# EAGLE design Linkable_LED_Matrix (EAGLE 7.0.0)
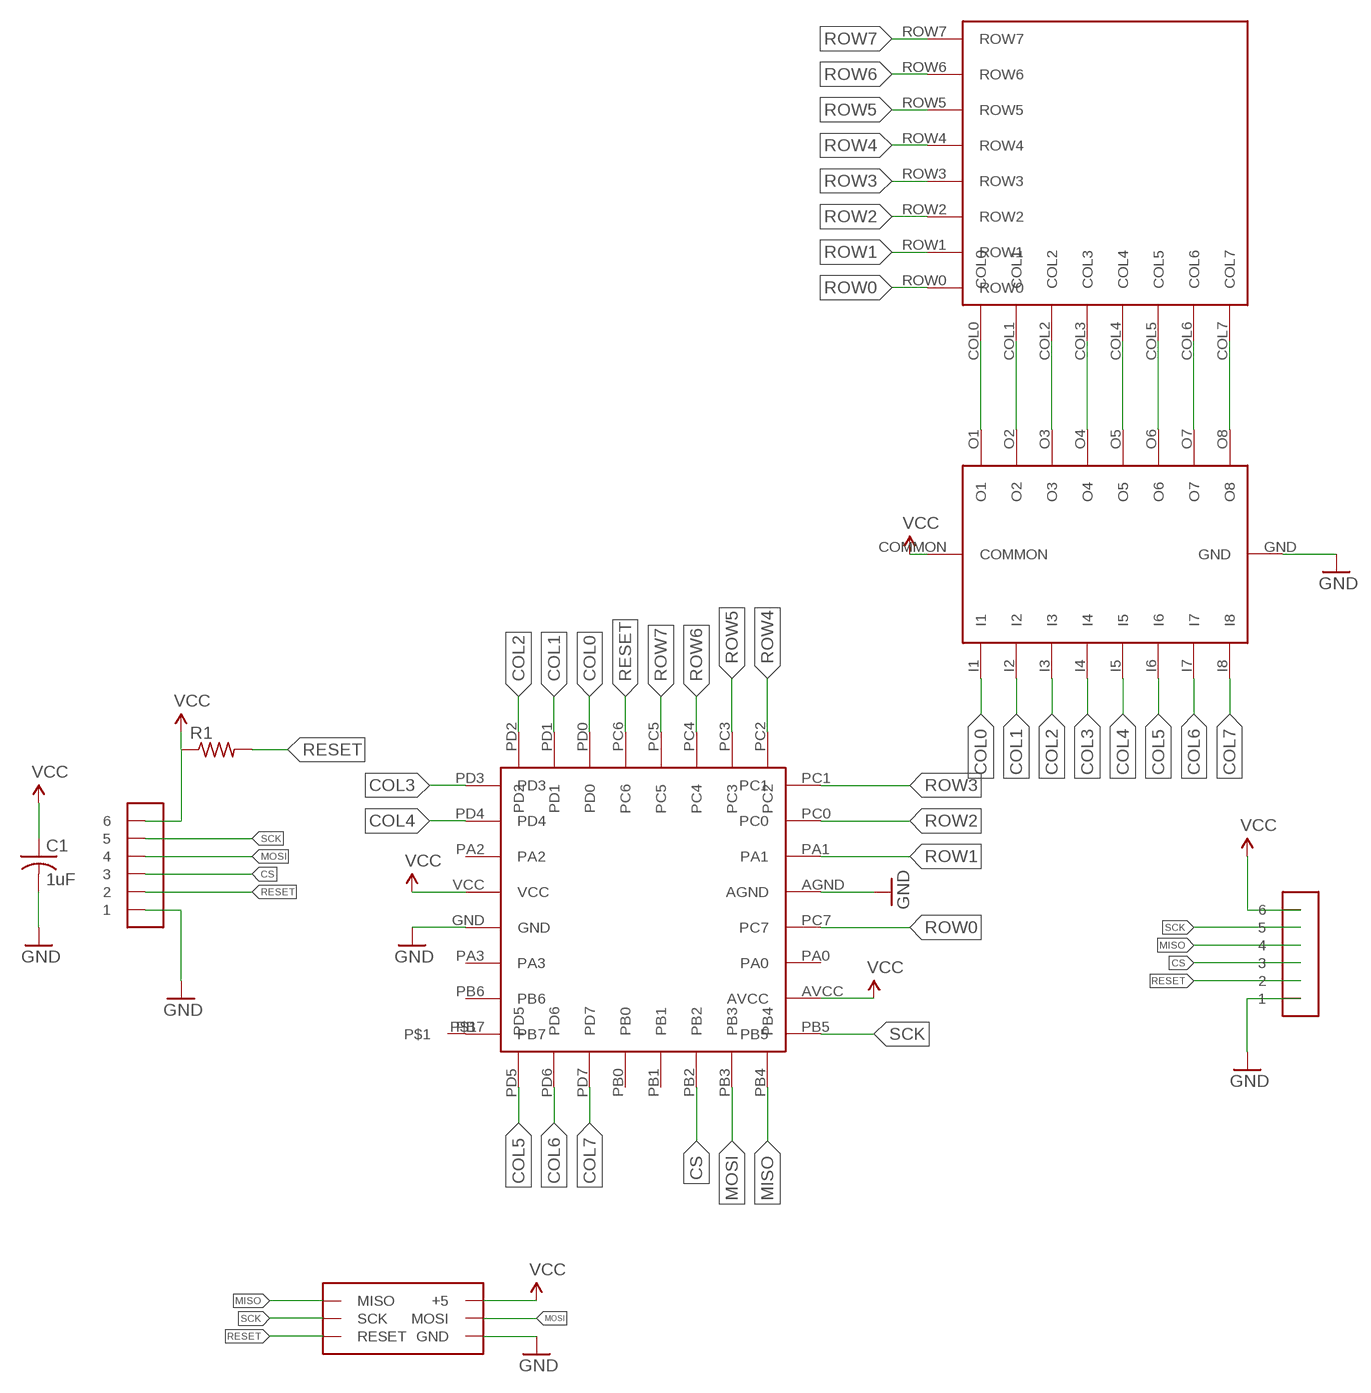
[diagram p0: schematic, sheet 1]

## Parts
C1  1uF  C-USC0603  [C0603]
R1  R-US_R0603  [R0603]
U$1  ATTINY48  [ATTINY48]
U$2  ULN2803AFWG  [ULN2803AFWG]
U$3  8X8_LED_MATRIX  [8X8_LED_MATRIX]
U$5  1X1MM_PAD  [1X1MM_PAD]
U$6  DIP1X6MALE  [DIP1X6MALE]
U$7  DIP1X6MALE  [DIP1X6MALE]
U$9  DIP2X3MALE  [DIP2X3MALE]

## Nets
COL0: U$1.PD0 U$2.I1
COL1: U$1.PD1 U$2.I2
COL2: U$1.PD2 U$2.I3
COL3: U$1.PD3 U$2.I4
COL4: U$1.PD4 U$2.I5
COL5: U$1.PD5 U$2.I6
COL6: U$1.PD6 U$2.I7
COL7: U$1.PD7 U$2.I8
CS: U$1.PB2 U$6.3 U$7.3
GND: C1.2 U$1.AGND U$1.GND U$2.GND U$6.1 U$7.1 U$9.GND
MISO: U$1.PB4 U$7.4 U$9.MISO
MOSI: U$1.PB3 U$6.4 U$9.MOSI
N$1: U$2.O1 U$3.COL0
N$2: U$2.O2 U$3.COL1
N$3: U$2.O3 U$3.COL2
N$4: U$2.O4 U$3.COL3
N$5: U$2.O5 U$3.COL4
N$6: U$2.O6 U$3.COL5
N$7: U$2.O7 U$3.COL6
N$8: U$2.O8 U$3.COL7
N$13: U$1.PB7 U$5.P$1
RESET: R1.2 U$1.PC6 U$6.2 U$7.2 U$9.RESET
ROW0: U$1.PC7 U$3.ROW0
ROW1: U$1.PA1 U$3.ROW1
ROW2: U$1.PC0 U$3.ROW2
ROW3: U$1.PC1 U$3.ROW3
ROW4: U$1.PC2 U$3.ROW4
ROW5: U$1.PC3 U$3.ROW5
ROW6: U$1.PC4 U$3.ROW6
ROW7: U$1.PC5 U$3.ROW7
SCK: U$1.PB5 U$6.5 U$7.5 U$9.SCK
VCC: C1.1 R1.1 U$1.AVCC U$1.VCC U$2.COMMON U$6.6 U$7.6 U$9.5V(+5)
Unconnected: U$1.PA0 U$1.PA2 U$1.PA3 U$1.PB0 U$1.PB1 U$1.PB6

## Library data of the parts
C1 = resistor:C-US: CAPACITOR, American symbol
R1 = resistor:R-US_: RESISTOR, American symbol
U$1 = ScottSilver:ATTINY48
U$2 = ScottSilver:ULN2803AFWG
U$3 = ScottSilver:8X8_LED_MATRIX
U$5 = ScottSilver:1X1MM_PAD
U$6 U$7 = ScottSilver:DIP1X6MALE
U$9 = ScottSilver:DIP2X3MALE

## Board
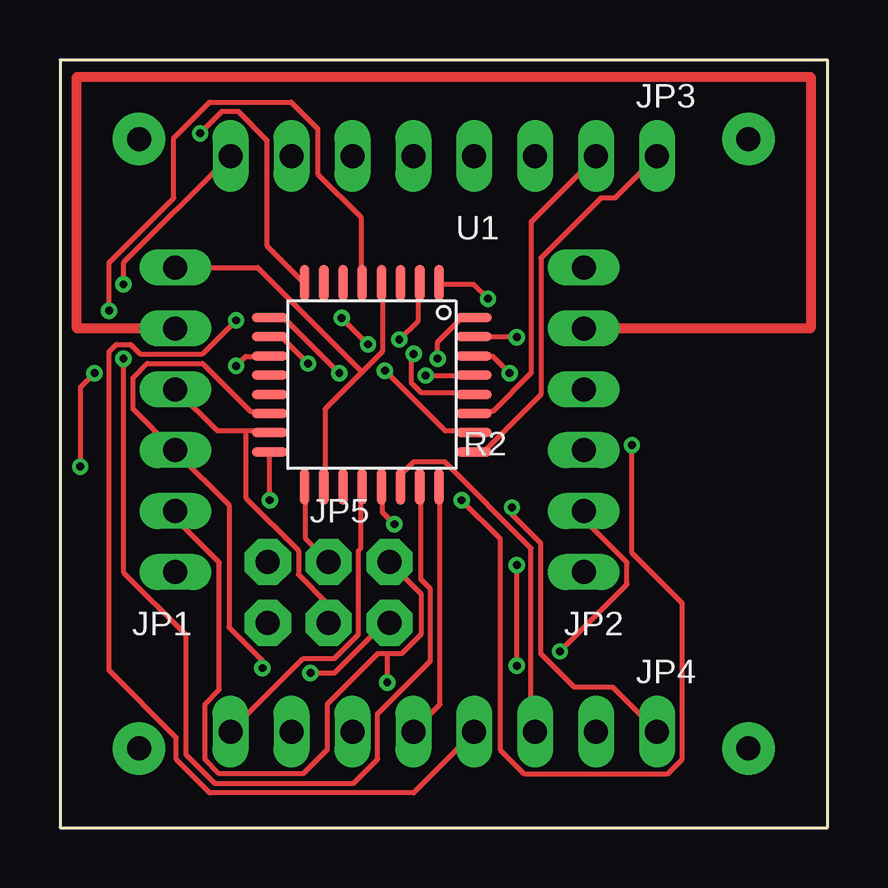
[diagram p1: board, top side]
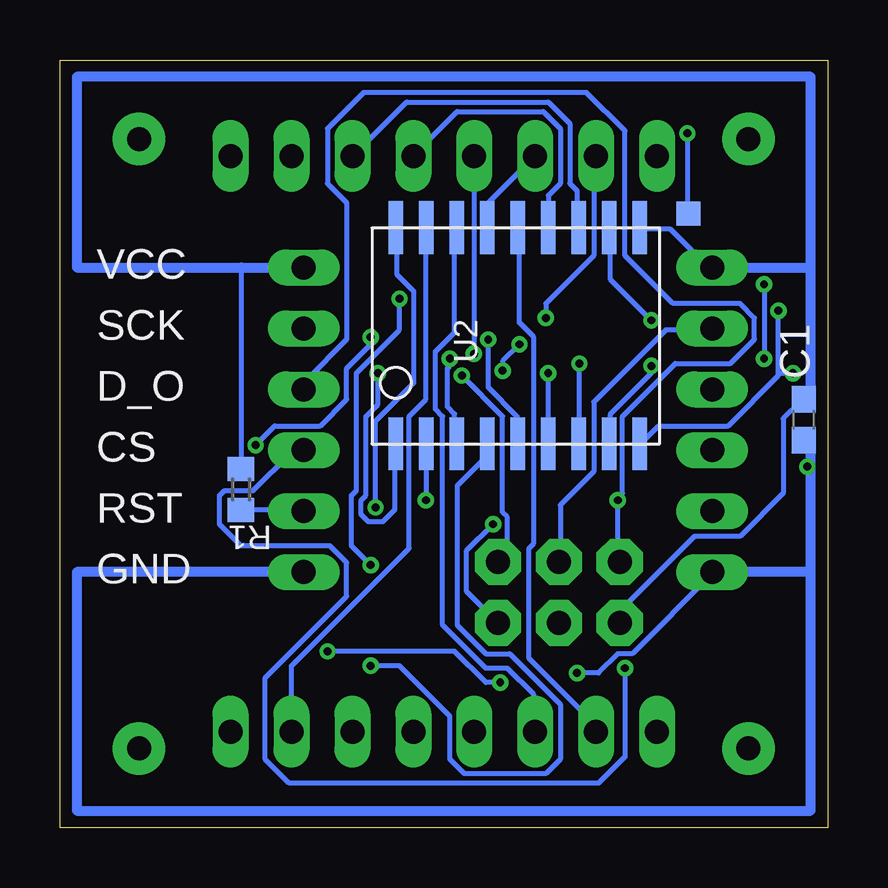
[diagram p2: board, bottom side, seen from below]

Size 32 x 32 mm. Coordinates in mm from the lower left corner, seen from the top.
Outline: 0,0 32,0 32,32 0,32 0,0
Copper layers (1*16): Top 0.0356mm / dielectric 1.5011mm / Bottom 0.0356mm
Design rules "LaenPCBOrder *": minimum track width 8mil, minimum drill 13mil, track to track 6mil, track to pad 6mil, pad to pad 6mil, via to via 6mil, smd to smd 6mil, copper to edge 15mil, drill to drill 6mil, minimum pad ring 7mil, minimum via ring 7mil, stop-mask expansion 3mil, vias tented up to drill 0mil, thermal gap 10mil
vRestrict: area 6.2,26.4 to 25.7,29.6; area 6.2,2.5 to 25.8,5.6; area 20.4,9.8 to 23.3,24.1; area 7.2,7.3 to 15.2,12.3; area 6.7,23.5 to 18.7,26.5; area 7.1,14.6 to 18.9,17.4; area 9.6,13.3 to 16.4,15.4; area 16.2,15.2 to 18.4,21.7; area 7.7,15 to 9.8,21.9; area 3,9 to 7,25; area 9.6,21.7 to 16.4,23.8

### Footprints (pad centres in the part's own frame; a part is rotated, then mirrored left to right if it is on the bottom)
C0603 = smd 1.1 x 1: 1 -0.85,0; 2 0.85,0
R0603 = smd 1 x 1.1: 1 -0.85,0; 2 0.85,0
ATTINY48 = smd 1.5 x 0.406: AGND 4.25,0.4; AVCC 4.25,-2; GND -4.25,-0.4; PA0 4.25,-1.2; PA1 4.25,1.2; PA2 -4.25,1.2; PA3 -4.25,-1.2; PB5 4.25,-2.8; PB6 -4.25,-2; PB7 -4.25,-2.8; PC0 4.25,2; PC1 4.25,2.8; PC7 4.25,-0.4; PD3 -4.25,2.8; PD4 -4.25,2; VCC -4.25,0.4 | smd 0.406 x 1.5: PB0 -0.4,-4.25; PB1 0.4,-4.25; PB2 1.2,-4.25; PB3 2,-4.25; PB4 2.8,-4.25; PC2 2.8,4.25; PC3 2,4.25; PC4 1.2,4.25; PC5 0.4,4.25; PC6 -0.4,4.25; PD0 -1.2,4.25; PD1 -2,4.25; PD2 -2.8,4.25; PD5 -2.8,-4.25; PD6 -2,-4.25; PD7 -1.2,-4.25
ULN2803AFWG = smd 0.6 x 2.2: COMMON 10.16,9.01; GND 10.16,0; I1 0,0; I2 1.27,0; I3 2.54,0; I4 3.81,0; I5 5.08,0; I6 6.35,0; I7 7.62,0; I8 8.89,0; O1 0,9.01; O2 1.27,9.01; O3 2.54,9.01; O4 3.81,9.01; O5 5.08,9.01; O6 6.35,9.01; O7 7.62,9.01; O8 8.89,9.01
8X8_LED_MATRIX = drill 1 long: COL0 8.89,-12; COL1 6.35,-12; COL2 -3.81,-12; COL3 -3.81,12; COL4 -6.35,-12; COL5 1.27,12; COL6 3.81,12; COL7 1.27,-12; ROW0 -8.89,-12; ROW1 3.81,-12; ROW2 -8.89,12; ROW3 -1.27,-12; ROW4 8.89,12; ROW5 -6.35,12; ROW6 6.35,12; ROW7 -1.27,12
1X1MM_PAD = smd 1 x 1: P$1 0,0
DIP1X6MALE = drill 1 long: 1 -6.35,0; 2 -3.81,0; 3 -1.27,0; 4 1.27,0; 5 3.81,0; 6 6.35,0
DIP2X3MALE = drill 1 pad 1.93 octagon: 5V -2.54,1.27; GND 2.54,1.27; MISO -2.54,-1.27; MOSI 0,1.27; RESET 2.54,-1.27; SCK 0,-1.27

### Placement (x,y rotation side)
C1  1,17 270 bottom
R1  24.45,14.1 270 bottom
U$1  13,18.46 270 top
U$2  18,16 0 bottom
U$3  16,16 0 top
U$5  5.8,25.6 0 bottom
U$6  4.81,17 90 top
U$7  21.84,17 90 top
U$9  11.2,9.8 180 bottom

### Tracks (layer width: path | path; a pad name or v marks a point on that pad's centre or on a via)
COL0  (via drill 0.33)
  Top 0.203: v18.74,18.94 18.04,19.64 17.34,19.64 U$1.PD0
  Bottom 0.203: v18.74,18.94 18.74,17.64 19.24,17.14 19.24,13.84 19.44,13.64 19.44,13.04 19.14,12.74 18.54,12.74 18.04,13.24 18.04,15.94 U$2.I1
COL1  (via drill 0.33)
  Top 0.203: v19.04,20.44 17.34,20.44 U$1.PD1 | v23.84,15.94 23.84,11.44 25.94,9.34 25.94,2.84 25.34,2.24 19.34,2.24 18.34,3.24 18.34,12.04 v16.74,13.64
  Bottom 0.203: v19.04,20.44 19.04,20.14 20.04,19.14 20.04,17.84 21.14,16.74 23.04,16.74 v23.84,15.94 | v16.74,13.64 16.74,15.94 U$2.I2
COL2  (via drill 0.33)
  Top 0.203: v15.74,19.54 15.74,20.24 16.74,21.24 17.24,21.24 U$1.PD2
  Bottom 0.203: v15.74,19.54 15.74,19.24 15.84,19.14 15.84,17.54 15.54,17.24 15.54,16.04 U$2.I3
COL3  (via drill 0.33)
  Top 0.203: v17.84,22.04 17.24,22.64 15.84,22.64 U$1.PD3 | v19.04,6.74 v19.04,10.94
  Bottom 0.203: v17.84,22.04 17.84,20.74 19.64,18.94 19.64,14.04 19.84,13.84 19.84,11.74 v19.04,10.94 | v19.04,6.74 17.84,6.74 15.74,4.64 15.74,2.84 15.14,2.24 11.74,2.24 11.14,2.84 11.14,5.14 13.24,7.24 14.24,7.24 15.44,8.44 15.44,14.24 14.24,15.44 14.24,15.94 U$2.I4
COL4  (via drill 0.33)
  Top 0.203: v14.14,20.34 14.94,21.14 14.94,22.64 U$1.PD4
  Bottom 0.203: v14.14,20.34 14.14,18.34 12.94,17.14 12.94,16.04 U$2.I5
COL5  (via drill 0.33)
  Top 0.203: v11.64,18.94 9.34,21.24 8.84,21.24 U$1.PD5
  Bottom 0.203: v11.64,18.94 11.64,16.04 U$2.I6
COL6  (via drill 0.33)
  Top 0.203: v10.34,19.34 9.24,20.44 8.84,20.44 U$1.PD6
  Bottom 0.203: v10.34,19.34 10.34,16.04 U$2.I7
COL7  (via drill 0.33)
  Top 0.203: v7.34,19.24 7.74,19.64 8.74,19.64 U$1.PD7
  Bottom 0.203: v7.34,19.24 7.34,18.94 9.04,17.24 9.04,16.04 U$2.I8
CS  (via drill 0.33)
  Top 0.203: U$1.PB2 8.74,17.34 7.94,17.34 5.94,19.34 3.64,19.34 3.04,18.74 3.04,17.44 4.74,15.74 U$6.3 4.84,15.64 7.04,13.44 7.04,8.34 8.44,6.94 v8.44,6.64
  Bottom 0.203: v8.44,6.64 8.44,2.94 9.54,1.84 22.44,1.84 23.44,2.84 23.44,6.24 20.04,9.64 20.04,11.04 20.74,11.74 24.44,11.74 25.34,12.64 25.34,13.84 25.14,14.04 23.94,14.04 22.34,15.64 21.84,15.64 U$7.3
GND  (via drill 0.33)
  Top 0.203: v13.94,12.64 13.44,13.14 13.44,14.14 U$1.AGND | v10.44,6.44 11.44,6.44 13.44,8.44 13.64,8.44 U$9.GND | v2.04,21.54 2.04,23.54 4.74,26.24 4.74,28.74 6.24,30.24 9.64,30.24 10.74,29.14 10.74,27.24 12.54,25.44 12.54,22.74 U$1.GND | v0.84,15.04 0.84,18.34 v1.44,18.94
  Bottom 0.203: v13.94,12.64 15.04,11.54 15.04,9.84 13.74,8.54 U$9.GND | v10.44,6.44 9.54,6.44 8.74,7.24 8.14,7.24 4.84,10.54 U$6.1 | 2.04,18.94 2.04,18.84 4.14,16.74 7.04,16.74 7.74,16.04 U$2.GND | 2.04,18.94 v2.04,21.54 | 2.04,18.94 v1.44,18.94 | v0.84,15.04 0.7,15.04
  Bottom 0.406: U$7.1 31.3,10.65 31.3,0.7 0.7,0.7 0.7,10.65 | 0.7,10.65 U$6.1 | 0.7,10.65 0.7,15.04 0.7,16.15 C1.2
MISO  (via drill 0.33)
  Top 0.203: v8.74,13.64 8.74,15.64 U$1.PB4
  Bottom 0.203: U$9.MISO 8.74,11.14 v8.74,13.64 8.74,13.74 8.54,13.94 8.54,17.14 6.34,19.34 4.04,19.34 3.04,20.34 3.04,21.24 3.64,21.84 6.44,21.84 8.44,23.84 8.44,29.04 10.04,30.64 19.34,30.64 20.84,29.14 20.84,26.84 20.04,26.04 20.04,20.34 21.74,18.64 21.74,18.34 U$7.4
MOSI
  Top 0.203: 7.74,16.54 6.54,16.54 4.84,18.24 U$6.4 | 7.74,16.54 8.74,16.54 U$1.PB3 | 7.74,16.54 7.74,13.74 9.94,11.54 9.94,10.54 11.14,9.34 11.14,8.54 U$9.MOSI
N$1  (via drill 0.33)
  Top 0.203: v18.84,13.34 18.84,13.04 20.04,11.84 20.04,7.24 21.44,5.84 23.04,5.84 24.84,4.04 U$3.COL0
  Bottom 0.203: v18.84,13.34 18.84,16.94 17.24,18.54 17.24,22.34 17.94,23.04 17.94,24.94 U$2.O1
N$2
  Bottom 0.203: U$2.O2 16.74,24.94 16.74,17.84 17.44,17.14 17.44,11.64 22.34,6.74 22.34,4.04 U$3.COL1
N$3
  Bottom 0.203: U$2.O3 15.54,24.94 15.54,20.64 16.34,19.84 16.34,17.44 16.04,17.14 16.04,8.44 14.24,6.64 13.34,6.64 12.24,5.54 12.24,4.04 U$3.COL2
N$4
  Bottom 0.203: U$2.O4 14.14,25.04 14.14,26.04 12.24,27.94 U$3.COL3
N$5
  Bottom 0.203: U$2.O5 12.84,24.94 12.84,21.04 12.24,20.44 12.24,11.84 12.44,11.64 12.44,7.04 9.74,4.34 9.74,4.04 U$3.COL4
N$6
  Bottom 0.203: U$2.O6 11.64,25.04 11.64,26.34 11.14,26.84 11.14,29.14 11.84,29.84 15.44,29.84 17.24,28.04 U$3.COL5
N$7
  Bottom 0.203: U$2.O7 10.44,25.04 10.44,26.54 10.74,26.84 10.74,29.34 11.64,30.24 17.54,30.24 19.74,28.04 U$3.COL6
N$8  (via drill 0.33)
  Top 0.203: v7.34,21.14 5.94,19.74 3.34,19.74 2.94,20.14 2.34,20.14 2.04,19.84 2.04,6.54 4.84,3.74 4.84,2.84 6.24,1.44 14.74,1.44 17.24,3.94 U$3.COL7
  Bottom 0.203: v7.34,21.14 9.04,22.84 9.04,24.94 U$2.O8
N$9  (via drill 1 pad 2.18)
  other vias: 3.3,3.3
N$10  (via drill 1 pad 2.18)
  other vias: 3.3,28.7
N$11  (via drill 1 pad 2.18)
  other vias: 28.7,28.7
N$12  (via drill 1 pad 2.18)
  other vias: 28.7,3.3
N$13  (via drill 0.33)
  Top 0.203: v5.84,28.94 6.74,29.84 7.44,29.84 8.64,28.64 8.64,24.24 10.14,22.74 U$1.PB7
  Bottom 0.203: v5.84,28.94 5.84,25.64 U$5.P$1
RESET  (via drill 0.33)
  Top 0.203: v15.24,18.84 17.24,18.84 U$1.PC6 | 13.64,7.24 14.24,7.24 15.04,8.04 15.04,9.74 13.74,11.04 U$9.RESET | 13.64,7.24 13.24,7.24 11.14,5.14 11.14,3.24 10.14,2.24 6.64,2.24 6.04,2.84 6.04,5.14 6.64,5.74 6.64,11.04 4.84,12.84 4.84,13.14 U$6.2 | v20.84,7.34 23.64,10.14 23.64,11.04 21.84,12.84 21.84,13.14 U$7.2 | 13.64,7.24 v13.64,6.04
  Bottom 0.203: R1.2 21.84,13.24 U$7.2 | v15.24,18.84 13.54,17.14 13.54,13.14 13.34,12.94 13.34,11.44 13.64,11.14 U$9.RESET | v20.84,7.34 15.54,7.34 14.24,6.04 v13.64,6.04
ROW0
  Top 0.203: U$1.PC7 12.54,14.14 12.54,11.64 12.44,11.54 12.44,8.04 11.44,7.04 10.14,7.04 7.14,4.04 U$3.ROW0
ROW1
  Top 0.203: U$1.PA1 14.24,14.24 14.24,14.74 14.74,15.24 16.04,15.24 19.64,11.64 19.64,4.14 19.74,4.04 U$3.ROW1
ROW2  (via drill 0.33)
  Top 0.203: v2.64,19.54 2.64,10.64 5.24,8.04 5.24,3.04 6.44,1.84 12.24,1.84 13.24,2.84 13.24,4.74 15.44,6.94 15.44,9.94 15.04,10.34 15.04,14.14 U$1.PC0 | v2.64,22.64 2.64,23.54 7.04,27.94 U$3.ROW2
  Bottom 0.203: v2.64,22.64 v2.64,19.54
ROW3
  Top 0.203: U$1.PC1 15.84,14.14 15.84,5.14 14.74,4.04 U$3.ROW3
ROW4
  Top 0.203: U$1.PC2 17.34,15.74 17.74,15.74 20.04,18.04 20.04,23.74 22.54,26.24 23.14,26.24 24.84,27.94 U$3.ROW4
ROW5  (via drill 0.33)
  Top 0.203: v13.54,19.04 16.04,16.54 17.24,16.54 U$1.PC3 | v11.74,21.24 v12.84,20.14
  Bottom 0.203: v13.54,19.04 13.54,19.44 v12.84,20.14 | v11.74,21.24 11.74,21.84 9.74,23.84 9.74,27.94 U$3.ROW5
ROW6
  Top 0.203: U$1.PC4 17.34,17.34 18.04,17.34 19.64,18.94 19.64,25.24 22.34,27.94 U$3.ROW6
ROW7  (via drill 0.33)
  Top 0.203: v14.74,19.74 14.64,19.64 14.64,18.54 15.04,18.14 17.24,18.14 U$1.PC5
  Bottom 0.203: v14.74,19.74 14.74,27.94 U$3.ROW7
SCK
  Top 0.203: U$1.PB5 10.24,14.14 10.24,12.04 11.14,11.14 U$9.SCK
  Top 0.406: U$6.5 0.7,20.81 0.7,31.3 31.3,31.3 31.3,20.81 U$7.5
  Bottom 0.203: U$9.SCK 11.14,11.14 11.14,13.44 9.74,14.84 9.74,17.74 6.74,20.74 4.84,20.74 U$6.5
VCC
  Top 0.203: 12.59,18.99 13.44,19.84 13.44,22.64 U$1.VCC | 12.59,18.99 11.04,17.44 11.04,14.24 U$1.AVCC | 12.59,18.99 8.24,23.34 4.84,23.34 U$6.6
  Bottom 0.203: 24.44,23.35 24.44,15.04 R1.1 | U$2.COMMON 7.74,24.94 6.54,24.94 4.94,23.34 U$6.6 | U$9.5V 8.64,8.54 8.64,9.04 5.54,12.14 3.64,12.14 1.84,13.94 1.84,17.04 1.14,17.74 C1.1
  Bottom 0.406: U$6.6 0.7,23.35 | 0.7,23.35 0.7,31.3 31.3,31.3 31.3,23.35 24.44,23.35 U$7.6 | C1.1 0.7,18.15 0.7,23.35

### Text on the board
tPlace: JP3 | U1 | R2 | JP5 | JP1 | JP2 | JP4
bPlace: VCC | U2 | SCK | D_O | CS | R1 | RST | GND